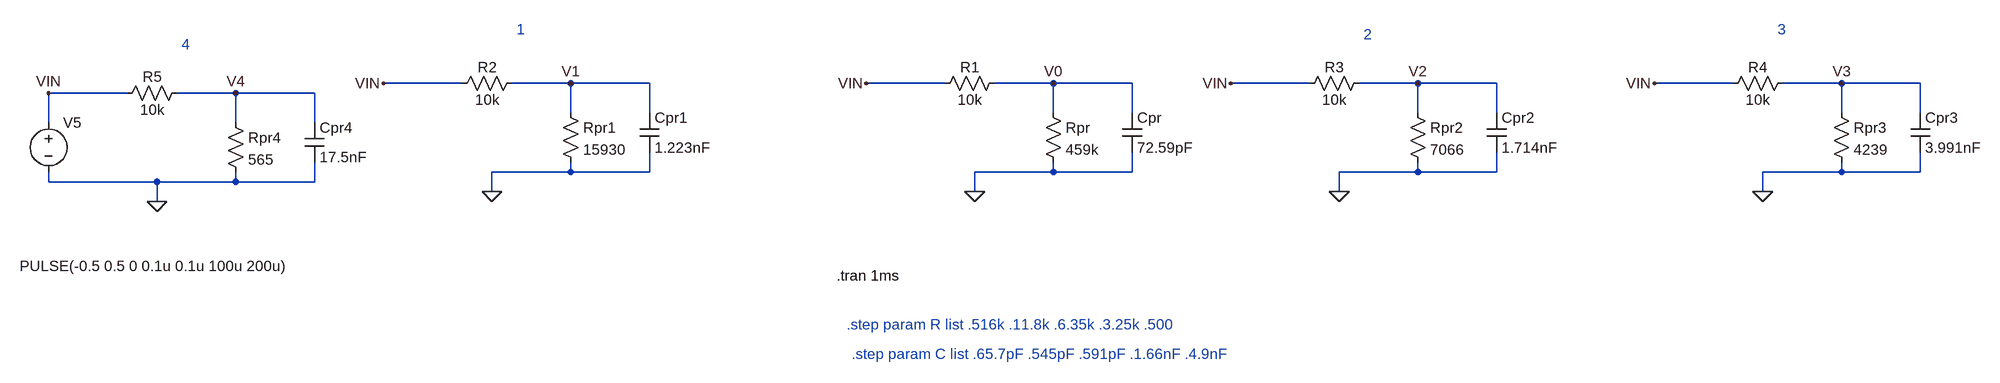
[diagram p0: schematic Simu_probe.asc]
Simu_probe.asc, the LTspice schematic file:
Version 4
SHEET 1 1712 680
WIRE -768 -48 -896 -48
WIRE -592 -48 -688 -48
WIRE -464 -48 -592 -48
WIRE 16 -48 -112 -48
WIRE 192 -48 96 -48
WIRE 320 -48 192 -48
WIRE 608 -48 480 -48
WIRE 784 -48 688 -48
WIRE 912 -48 784 -48
WIRE 1296 -48 1168 -48
WIRE 1472 -48 1376 -48
WIRE 1600 -48 1472 -48
WIRE -1312 -32 -1440 -32
WIRE -1136 -32 -1232 -32
WIRE -1008 -32 -1136 -32
WIRE -592 0 -592 -48
WIRE -464 0 -464 -48
WIRE 192 0 192 -48
WIRE 320 0 320 -48
WIRE 784 0 784 -48
WIRE 912 0 912 -48
WIRE 1472 0 1472 -48
WIRE 1600 0 1600 -48
WIRE -1440 16 -1440 -32
WIRE -1136 16 -1136 -32
WIRE -1008 16 -1008 -32
WIRE -592 96 -592 80
WIRE -592 96 -720 96
WIRE -464 96 -464 64
WIRE -464 96 -592 96
WIRE 192 96 192 80
WIRE 192 96 64 96
WIRE 320 96 320 64
WIRE 320 96 192 96
WIRE 784 96 784 80
WIRE 784 96 656 96
WIRE 912 96 912 64
WIRE 912 96 784 96
WIRE 1472 96 1472 80
WIRE 1472 96 1344 96
WIRE 1600 96 1600 64
WIRE 1600 96 1472 96
WIRE -1440 112 -1440 96
WIRE -1264 112 -1440 112
WIRE -1136 112 -1136 96
WIRE -1136 112 -1264 112
WIRE -1008 112 -1008 80
WIRE -1008 112 -1136 112
WIRE -720 128 -720 96
WIRE 64 128 64 96
WIRE 656 128 656 96
WIRE 1344 128 1344 96
WIRE -1264 144 -1264 112
FLAG 64 128 0
FLAG -720 128 0
FLAG 656 128 0
FLAG 1344 128 0
FLAG -1264 144 0
FLAG 1472 -48 V3
FLAG 784 -48 V2
FLAG 192 -48 V0
FLAG -592 -48 V1
FLAG -1136 -32 V4
FLAG -1440 -32 VIN
FLAG -896 -48 VIN
FLAG -112 -48 VIN
FLAG 480 -48 VIN
FLAG 1168 -48 VIN
SYMBOL res 0 -32 R270
WINDOW 0 27 56 VTop 2
WINDOW 3 5 56 VBottom 2
SYMATTR InstName R1
SYMATTR Value 10k
SYMBOL res 176 -16 R0
SYMATTR InstName Rpr
SYMATTR Value 459k
SYMBOL cap 304 0 R0
SYMATTR InstName Cpr
SYMATTR Value 72.59pF
SYMBOL res -784 -32 R270
WINDOW 0 27 56 VTop 2
WINDOW 3 5 56 VBottom 2
SYMATTR InstName R2
SYMATTR Value 10k
SYMBOL res -608 -16 R0
SYMATTR InstName Rpr1
SYMATTR Value 15930
SYMBOL cap -480 0 R0
SYMATTR InstName Cpr1
SYMATTR Value 1.223nF
SYMBOL res 592 -32 R270
WINDOW 0 27 56 VTop 2
WINDOW 3 5 56 VBottom 2
SYMATTR InstName R3
SYMATTR Value 10k
SYMBOL res 768 -16 R0
SYMATTR InstName Rpr2
SYMATTR Value 7066
SYMBOL cap 896 0 R0
SYMATTR InstName Cpr2
SYMATTR Value 1.714nF
SYMBOL res 1280 -32 R270
WINDOW 0 27 56 VTop 2
WINDOW 3 5 56 VBottom 2
SYMATTR InstName R4
SYMATTR Value 10k
SYMBOL res 1456 -16 R0
SYMATTR InstName Rpr3
SYMATTR Value 4239
SYMBOL cap 1584 0 R0
SYMATTR InstName Cpr3
SYMATTR Value 3.991nF
SYMBOL voltage -1440 0 R0
WINDOW 3 -47 249 Left 2
WINDOW 123 -155 164 Left 2
WINDOW 39 0 0 Left 2
SYMATTR Value PULSE(-0.5 0.5 0 0.1u 0.1u 100u 200u)
SYMATTR InstName V5
SYMBOL res -1328 -16 R270
WINDOW 0 27 56 VTop 2
WINDOW 3 5 56 VBottom 2
SYMATTR InstName R5
SYMATTR Value 10k
SYMBOL res -1152 0 R0
SYMATTR InstName Rpr4
SYMATTR Value 565
SYMBOL cap -1024 16 R0
SYMATTR InstName Cpr4
SYMATTR Value 17.5nF
TEXT -160 264 Left 2 !.tran 1ms
TEXT -144 344 Left 2 ;.step param R list .516k .11.8k .6.35k .3.25k .500
TEXT -136 392 Left 2 ;.step param C list .65.7pF .545pF .591pF .1.66nF .4.9nF
TEXT -1224 -112 Left 2 ;4
TEXT 1368 -136 Left 2 ;3
TEXT 696 -128 Left 2 ;2
TEXT -680 -136 Left 2 ;1

The netlist it stands for:
* Simu_probe.asc
R1 VIN V0 10k
Rpr V0 0 459k
Cpr V0 0 72.59pF
R2 VIN V1 10k
Rpr1 V1 0 15930
Cpr1 V1 0 1.223nF
R3 VIN V2 10k
Rpr2 V2 0 7066
Cpr2 V2 0 1.714nF
R4 VIN V3 10k
Rpr3 V3 0 4239
Cpr3 V3 0 3.991nF
V5 VIN 0 PULSE(-0.5 0.5 0 0.1u 0.1u 100u 200u)
R5 VIN V4 10k
Rpr4 V4 0 565
Cpr4 V4 0 17.5nF
.tran 1ms
* .step param R list .516k .11.8k .6.35k .3.25k .500
* .step param C list .65.7pF .545pF .591pF .1.66nF .4.9nF
* 4
* 3
* 2
* 1
.backanno
.end

* Results of the author's LTspice run, read from the files saved beside the schematic
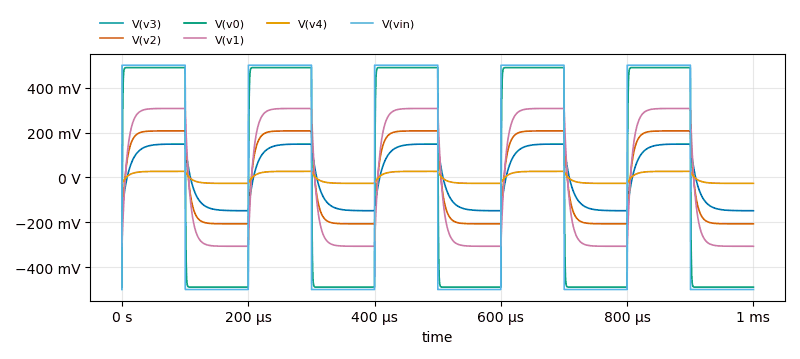
[diagram p1: Transient Analysis of Simu_probe.asc, plotted from the saved traces]
* Transient Analysis, 1 run:
*   V(v3): min -148.9 mV, max 148.8 mV, average 147.9 µV, rms 130 mV, last -148.8 mV
*   V(v2): min -207 mV, max 207 mV, average 206.8 µV, rms 191.8 mV, last -207 mV
*   V(v0): min -489.3 mV, max 489.3 mV, average 488.8 µV, rms 485.8 mV, last -489.3 mV
*   V(v1): min -307.2 mV, max 307.2 mV, average 306.9 µV, rms 283.2 mV, last -307.2 mV
*   V(v4): min -26.74 mV, max 26.74 mV, average 26.7 µV, rms 24.11 mV, last -26.74 mV
*   V(vin): min -500 mV, max 500 mV, average 500 µV, rms 499.8 mV, last -500 mV